# EAGLE design SolarMonitor_Pro (EAGLE 9.2.1)
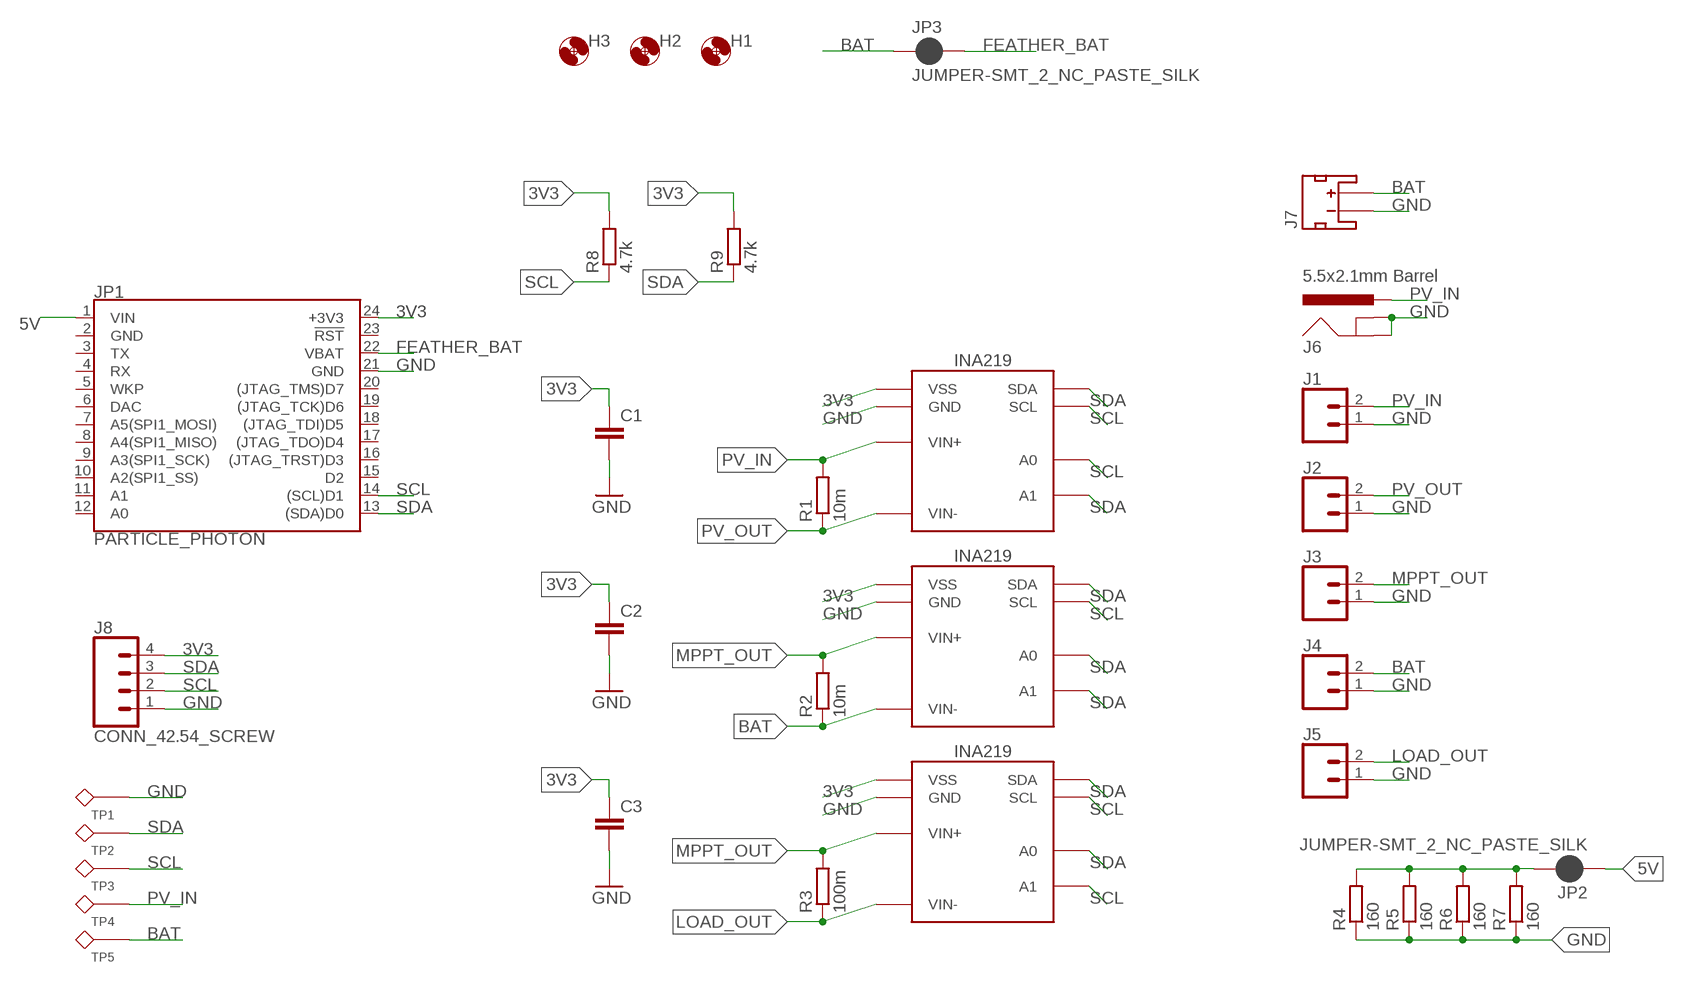
[diagram p0: schematic, sheet 1]

## Parts
C1  C-EU0.1UFC0402  [C0402]
C2  C-EU0.1UFC0402  [C0402]
C3  C-EU0.1UFC0402  [C0402]
H1  MOUNTING_HOLE4_NP  [4_40]
H2  MOUNTING_HOLE4_NP  [4_40]
H3  MOUNTING_HOLE4_NP  [4_40]
J1  CONN_023.5MM  [SCREWTERMINAL-3.5MM-2]
J2  CONN_023.5MM  [SCREWTERMINAL-3.5MM-2]
J3  CONN_023.5MM  [SCREWTERMINAL-3.5MM-2]
J4  CONN_023.5MM  [SCREWTERMINAL-3.5MM-2]
J5  CONN_023.5MM  [SCREWTERMINAL-3.5MM-2]
J6  5.5x2.1mm Barrel  POWER_JACKSMD  [POWER_JACK_SMD]
J7  JST_2MM_MALE  [JST-2-SMD]
J8  CONN_42.54_SCREW  [1X04_SCREW]
JP1  PARTICLE_PHOTON  [PARTICLE_PHOTON]
JP2  JUMPER-SMT_2_NC_PASTE_SILK  [SMT-JUMPER_2_NC_PASTE_SILK]
JP3  JUMPER-SMT_2_NC_PASTE_SILK  [SMT-JUMPER_2_NC_PASTE_SILK]
R1  10m  R-EU_R0805  [R0805]
R2  10m  R-EU_R0805  [R0805]
R3  100m  R-EU_R0805  [R0805]
R4  160  R-EU_R1206  [R1206]
R5  160  R-EU_R1206  [R1206]
R6  160  R-EU_R1206  [R1206]
R7  160  R-EU_R1206  [R1206]
R8  4.7k  R-EU_4.7KR0402  [R0402]
R9  4.7k  R-EU_4.7KR0402  [R0402]
TP1  TESTPOINTRCU  [TESTPOINT_0603]
TP2  TESTPOINTRCU  [TESTPOINT_0603]
TP3  TESTPOINTRCU  [TESTPOINT_0603]
TP4  TESTPOINTRCU  [TESTPOINT_0603]
TP5  TESTPOINTRCU  [TESTPOINT_0603]
U1  INA219DCN  [DCN_R-PDSO-G8]
U2  INA219DCN  [DCN_R-PDSO-G8]
U3  INA219DCN  [DCN_R-PDSO-G8]

## Nets
3V3: C1.1 C2.1 C3.1 J8.4 JP1.24(+3V3) R8.2 R9.2 U1.4(VSS) U2.4(VSS) U3.4(VSS)
5V: JP1.1(VIN) JP2.1
BAT: J4.2 J7.2(+) JP3.1 R2.1 TP5.1 U2.2(VIN-)
FEATHER_BAT: JP1.22(VBAT) JP3.2
GND: C1.2 C2.2 C3.2 J1.1 J2.1 J3.1 J4.1 J5.1 J6.GND(GNDBREAK) J6.P$4(GND) J7.1(-) J8.1 JP1.21(GND) R4.1 R5.1 R6.1 R7.1 TP1.1 U1.3(GND) U2.3(GND) U3.3(GND)
LOAD: JP2.2 R4.2 R5.2 R6.2 R7.2
LOAD_OUT: J5.2 R3.1 U3.2(VIN-)
MPPT_OUT: J3.2 R2.2 R3.2 U2.1(VIN+) U3.1(VIN+)
PV_IN: J1.2 J6.VIN0(PWR) R1.2 TP4.1 U1.1(VIN+)
PV_OUT: J2.2 R1.1 U1.2(VIN-)
SCL: J8.2 JP1.14((SCL)D1) R8.1 TP3.1 U1.5(SCL) U1.7(A0) U2.5(SCL) U3.5(SCL) U3.8(A1)
SDA: J8.3 JP1.13((SDA)D0) R9.1 TP2.1 U1.6(SDA) U1.8(A1) U2.6(SDA) U2.7(A0) U2.8(A1) U3.6(SDA) U3.7(A0)
Unconnected: J7.NC1(PAD1) J7.NC2(PAD2) JP1.3(TX) JP1.4(RX) JP1.5(WKP) JP1.6(DAC) JP1.7(A5(SPI1_MOSI)) JP1.8(A4(SPI1_MISO)) JP1.9(A3(SPI1_SCK)) JP1.10(A2(SPI1_SS)) JP1.11(A1) JP1.12(A0) JP1.15(D2) JP1.16((JTAG_TRST)D3) JP1.17((JTAG_TDO)D4) JP1.18((JTAG_TDI)D5) JP1.19((JTAG_TCK)D6) JP1.20((JTAG_TMS)D7) JP1.23(!RST!)

## Power pins joined to a net without a drawn wire
GND: JP1.2(GND)

## Library data of the parts
C1-C3 = bschulz_passives:C-EU: CAPACITOR, European symbol; DIGIKEY: 490-4759-1-ND; MF: Murata; MPN: GCM155R71C104KA55D
H1-H3 = bschulz:MOUNTING_HOLE: Genaric Mechanical Mounting Hole Hole diameter based on max body diameter + 15% Keepout ring is for diameter of socket cap screw (minimum required clearance) TPlace ring is for diameter of pan head screw (recomended clearance) Specifications: Socket Cap <http://fastener-express.com/fastener-technical/SocketscapSS-Alloy.pdf> Button Head Socket Cap <http://fastener-express.com/fastener-technical/Button-Socket-alloy.pdf> Pan Head <http://fastener-express.com/fastener-technical/pan-machine-Screws.pdf>
J1-J5 = bschulz:CONN_02: Genaric 2 terminal header SCREW_2.54 <https://www.digikey.com/product-detail/en/on-shore-technology-inc/OSTVN02A150/ED10561-ND/1588862>; PROD_ID: CONN-08399
J6 = bschulz:POWER_JACK: Power Jack Connector This is the standard 5.5mm barrel jack for power. The PTH is the most common, proven, reliable, footprint. The Slot footprint only works if the mill layer is transmitted to the PCB fab house so be warned. Here are the connectors we sell at SparkFun: DC Barrel Power Jack/Connector <https://www.sparkfun.com/products/119> (PRT-00119) DC Barrel Power Jack/Connector (SMD) <https://www.sparkfun.com/products/12748> (PRT-12748) DC Barrel Jack Adapter - Breadboard Compatible <https://www.sparkfun.com/products/10811> (PRT-10811) It is used on this SparkFun product (and many, many others): SparkFun RedBoard - Programmed with Arduino <https://www.sparkfun.com/products/12757> (DEV-12757) Also, if you need a mating power supply or connector, please check these out: Wall Adapter Power Supply - 9VDC 650mA <https://www.sparkfun.com/products/298> (TOL-00298) DC Barrel Jack Adapter - Male <https://www.sparkfun.com/products/10287> (PRT-10287); DIGIKEY: 732-5929-1-ND; MF: Wurth; MPN: 694106106102
J7 = bschulz:JST_2MM_MALE: JST 2MM MALE RA CONNECTOR Two pin, compact surface mount connector. Commonly used as a battery input connection point. We really like the solid locking feeling and high current rating on these small connectors. We use these all the time as battery connectors. Mates to single-cell LiPo batteries. Here is the connector we sell at SparkFun: JST Right Angle Connector - White <https://www.sparkfun.com/products/8612> (PRT-08612) Datasheet <http://www.sparkfun.com/datasheets/Prototyping/Connectors/JST-Horizontal.pdf> It was used on these SparkFun products: SparkFun MOSFET Power Controller <https://www.sparkfun.com/products/11214> (PRT-11214) SparkFun Battery Babysitter - LiPo Battery Manager <https://www.sparkfun.com/products/13777> (PRT-13777) And many, many others that required a lipo battery connection.; DIGIKEY: 455-1749-1-ND; MF: JST; MPN: S2B-PH-SM4-TB(LF)(SN)
J8 = bschulz:CONN_4: Genaric 4 terminal header Digikey 2.54_SCREW <https://www.digikey.com/product-detail/en/on-shore-technology-inc/OSTVN04A150/ED10563-ND/1588864>; DIGIKEY: ED10563-ND; MF: On Shore; MPN: OSTVN04A150
JP1 = SparkFun-Boards:PARTICLE_PHOTON: Particle Photon Footprint of the Particle Photon that is used as a basis for many Photon shields. SparkFun Products: Particle Photon <https://www.sparkfun.com/products/13764> SparkFun Photon ProtoShield <https://www.sparkfun.com/products/13598> SparkFun Photon micro OLED Shield <https://www.sparkfun.com/products/13628> SparkFun Photon IMU Shield <https://www.sparkfun.com/products/13629> SparkFun Photon Battery Shield <https://www.sparkfun.com/products/13626>
JP2 JP3 = SparkFun-Jumpers:JUMPER-SMT_2_NC_PASTE: Normally closed solder jumper This jumper has an aperture in the stencil to allow solder paste to bridge the split in the wire so it's normally closed (NC). Wick off the solder to open the connection. Reapply solder to reclose the connection.
R1-R7 = bschulz_passives:R-EU_: RESISTOR, European symbol Digikey Parts: Yageo, 0402 <https://www.digikey.com/products/en/resistors/chip-resistor-surface-mount/52?k=&pkeyword=&sf=0&FV=ffec1104%2Cfffc000d%2C1c0002%2C440067%2C1f140000%2Cffe00034%2C400004&quantity=&ColumnSort=0&page=1&stock=1&pageSize=25> Yageo, 0603 <https://www.digikey.com/products/en/resistors/chip-resistor-surface-mount/52?k=&pkeyword=&s=4356&s=47360&sf=0&FV=fffc000d%2C1c0002%2C142c040c%2C1f140000%2Cffe00034&quantity=10&ColumnSort=1000011&page=1&stock=1&pageSize=25> Panasonic, 0603 <https://www.digikey.com/products/en/resistors/chip-resistor-surface-mount/52?k=&pkeyword=&pv252=68&sf=0&FV=ffec373d%2C1c0002%2C142c040c%2C1f140000%2Cffe00034%2C80002%2Cc0001&quantity=&ColumnSort=0&page=1&stock=1&pageSize=25> Panasonic, precision, 0603 <https://www.digikey.com/products/en/resistors/chip-resistor-surface-mount/52?FV=ffec4907%2Cfffc000a%2Cc0172%2C142c040c%2C1f140000%2Cffe00034%2C1c0002&quantity=100&ColumnSort=2085&page=1&stock=1&pageSize=25> Panasonic, 0805 <https://www.digikey.com/products/en/resistors/chip-resistor-surface-mount/52?k=&pkeyword=&pv3=1&sf=0&FV=ffec373d%2C1c0002%2C1f140000%2Cffe00034%2C142c040d&quantity=&ColumnSort=0&page=1&stock=1&pageSize=25> Rohm, current sense <https://www.digikey.com/products/en/resistors/chip-resistor-surface-mount/52?k=&pkeyword=&pv3=1&sf=0&FV=ffecb688%2C1f140000%2Cffe00034%2C1c0002&quantity=&ColumnSort=0&page=1&stock=1&pageSize=25> Vishay, pulse proof automotive <https://www.digikey.com/products/en/resistors/chip-resistor-surface-mount/52?k=&pkeyword=&pv7=2&sf=0&FV=ffec5d6b%2Cffe00034%2C1f140000&quantity=&ColumnSort=0&page=1&stock=1&pageSize=25>
R8 R9 = bschulz_passives:R-EU_: RESISTOR, European symbol Digikey Parts: Yageo, 0402 <https://www.digikey.com/products/en/resistors/chip-resistor-surface-mount/52?k=&pkeyword=&sf=0&FV=ffec1104%2Cfffc000d%2C1c0002%2C440067%2C1f140000%2Cffe00034%2C400004&quantity=&ColumnSort=0&page=1&stock=1&pageSize=25> Yageo, 0603 <https://www.digikey.com/products/en/resistors/chip-resistor-surface-mount/52?k=&pkeyword=&s=4356&s=47360&sf=0&FV=fffc000d%2C1c0002%2C142c040c%2C1f140000%2Cffe00034&quantity=10&ColumnSort=1000011&page=1&stock=1&pageSize=25> Panasonic, 0603 <https://www.digikey.com/products/en/resistors/chip-resistor-surface-mount/52?k=&pkeyword=&pv252=68&sf=0&FV=ffec373d%2C1c0002%2C142c040c%2C1f140000%2Cffe00034%2C80002%2Cc0001&quantity=&ColumnSort=0&page=1&stock=1&pageSize=25> Panasonic, precision, 0603 <https://www.digikey.com/products/en/resistors/chip-resistor-surface-mount/52?FV=ffec4907%2Cfffc000a%2Cc0172%2C142c040c%2C1f140000%2Cffe00034%2C1c0002&quantity=100&ColumnSort=2085&page=1&stock=1&pageSize=25> Panasonic, 0805 <https://www.digikey.com/products/en/resistors/chip-resistor-surface-mount/52?k=&pkeyword=&pv3=1&sf=0&FV=ffec373d%2C1c0002%2C1f140000%2Cffe00034%2C142c040d&quantity=&ColumnSort=0&page=1&stock=1&pageSize=25> Rohm, current sense <https://www.digikey.com/products/en/resistors/chip-resistor-surface-mount/52?k=&pkeyword=&pv3=1&sf=0&FV=ffecb688%2C1f140000%2Cffe00034%2C1c0002&quantity=&ColumnSort=0&page=1&stock=1&pageSize=25> Vishay, pulse proof automotive <https://www.digikey.com/products/en/resistors/chip-resistor-surface-mount/52?k=&pkeyword=&pv7=2&sf=0&FV=ffec5d6b%2Cffe00034%2C1f140000&quantity=&ColumnSort=0&page=1&stock=1&pageSize=25>; DIGIKEY: 311-4.7KJRCT-ND; MF: Yageo; MPN: RC0402JR-074K7L; VALUE_PART: 4.7k
TP1-TP5 = bschulz:TESTPOINT; DIGIKEY: A106145CT-ND; MF: TE Connectivity; MPN: RCU-0C
U1-U3 = bschulz:INA219: INA219 - Zero Drift Bidirectional Current/Power Monitor with I2C Interface Characteristics: Vcc: 3V ~ 5.5V Iq: 700uA Common Mode Range: 0V ~ 26V Operating Temperature: -40°C to 125°C Digikey: SOIC (D) <https://www.digikey.com/product-detail/en/texas-instruments/INA219AIDR/296-23978-1-ND/1984895> SOT-23 (DCN) <https://www.digikey.com/product-detail/en/texas-instruments/INA219AIDCNR/296-23770-1-ND/1952550>; DIGIKEY: 296-23770-1-ND; MF: TI; MPN: INA219AIDCNR

## Board
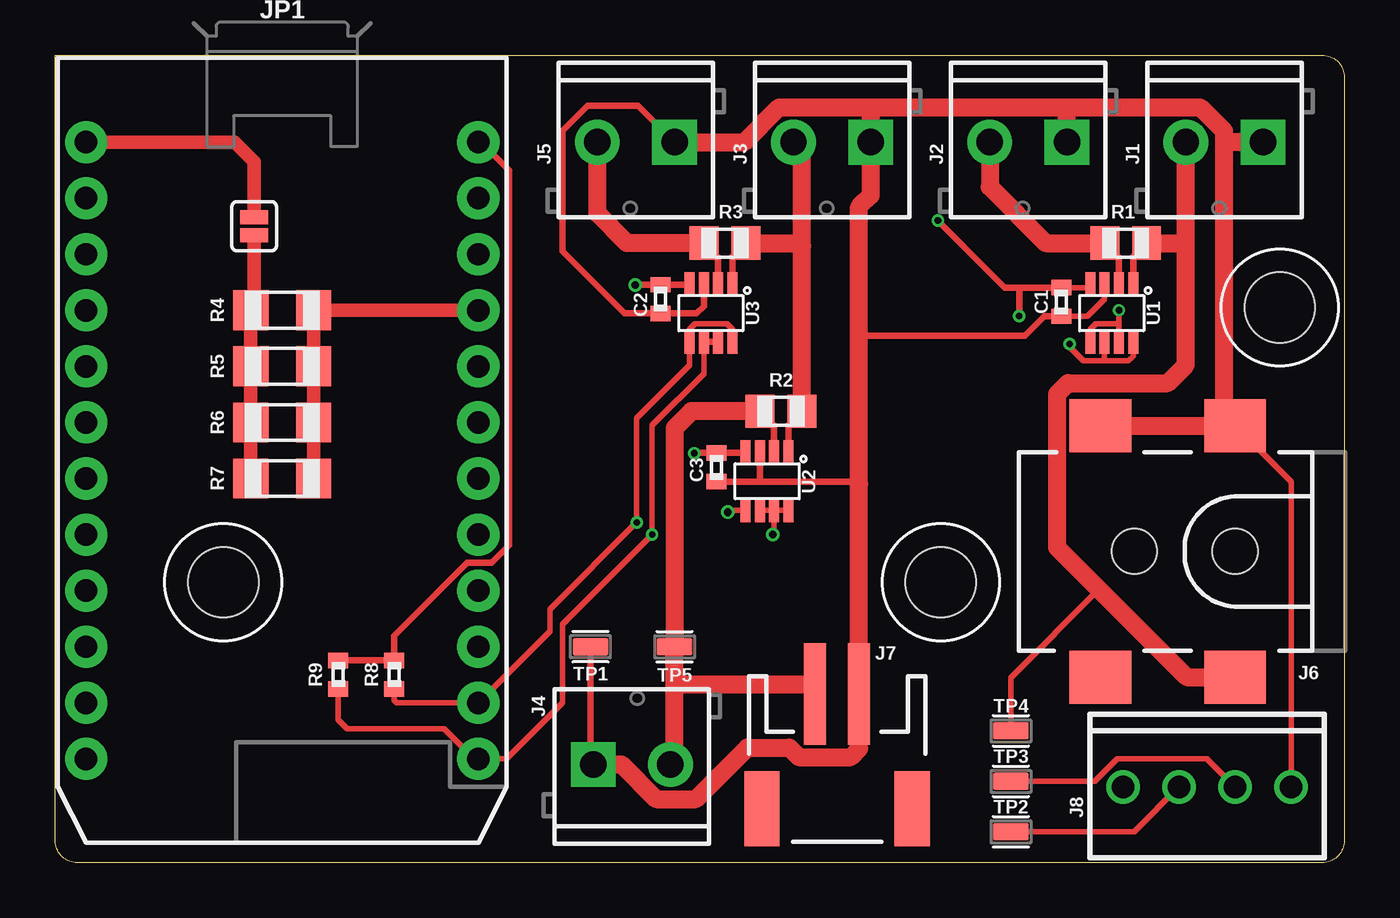
[diagram p1: board, top side]
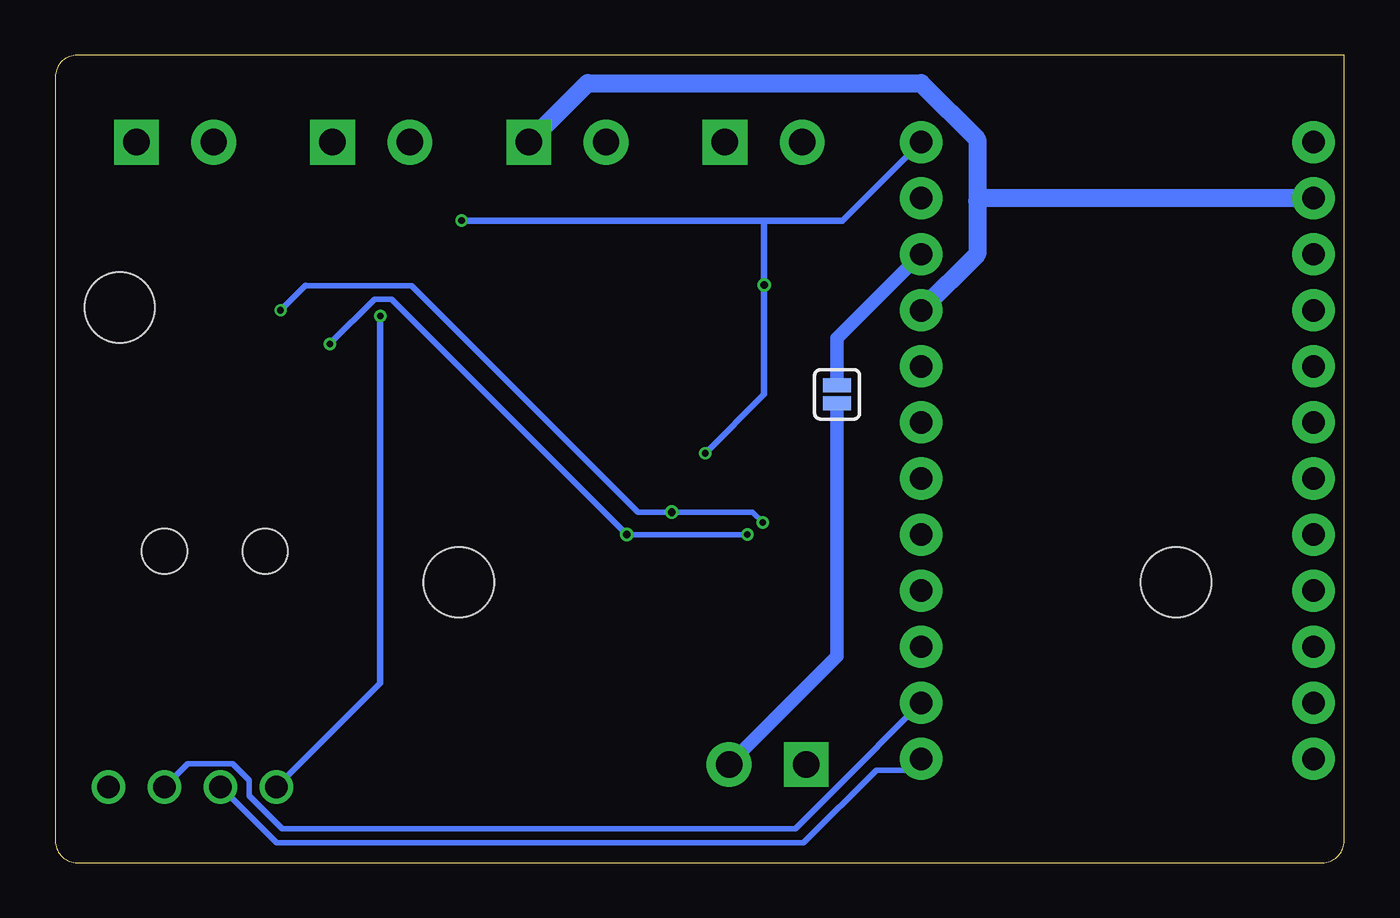
[diagram p2: board, bottom side, seen from below]

Size 58.42 x 36.58 mm. Coordinates in mm from the lower left corner, seen from the top.
Outline: 0,36.58 57.42,36.58 arc-90 58.42,35.58 58.42,1 arc-90 57.42,0 1,0 arc-90 0,1 0,36.58
Copper layers (1*16): Top 0.035559375mm / dielectric 1.6mm / Bottom 0.035559375mm
Design rules "oshpark-2layer": minimum track width 6mil, minimum drill 10mil, track to track 6mil, track to pad 6mil, pad to pad 6mil, via to via 6mil, smd to smd 6mil, copper to edge 15mil, drill to drill 6mil, minimum pad ring 5mil, minimum via ring 5mil, stop-mask expansion 2.5mil, vias tented up to drill 0mil, thermal gap 10mil

### Footprints (pad centres in the part's own frame; a part is rotated, then mirrored left to right if it is on the bottom)
C0402 = smd 0.7 x 0.9: 1 -0.65,0; 2 0.65,0
4_40 = hole 3.175: 0,0
SCREWTERMINAL-3.5MM-2 = drill 1.2 pad 2.032 square: 1 0,0 | drill 1.2 pad 2.032: 2 3.5,0
POWER_JACK_SMD = smd 2.8 x 2.4: GND 0,-5.7; P$4 6.1,-5.7; VIN0 0,5.7; VIN1 6.1,5.7 | hole 2.032: 0,0; 4.572,0
JST-2-SMD = smd 1 x 4.6: 1 -1,-3.7; 2 1,-3.7 | smd 1.6 x 3.4: NC1 -3.4,1.5; NC2 3.4,1.5
1X04_SCREW = drill 1.016: 1 -3.81,0; 2 -1.27,0; 3 1.27,0; 4 3.81,0
PARTICLE_PHOTON = drill 1.016 pad 1.905: 1 -8.89,13.97; 2 -8.89,11.43; 3 -8.89,8.89; 4 -8.89,6.35; 5 -8.89,3.81; 6 -8.89,1.27; 7 -8.89,-1.27; 8 -8.89,-3.81; 9 -8.89,-6.35; 10 -8.89,-8.89; 11 -8.89,-11.43; 12 -8.89,-13.97; 13 8.89,-13.97; 14 8.89,-11.43; 15 8.89,-8.89; 16 8.89,-6.35; 17 8.89,-3.81; 18 8.89,-1.27; 19 8.89,1.27; 20 8.89,3.81; 21 8.89,6.35; 22 8.89,8.89; 23 8.89,11.43; 24 8.89,13.97
SMT-JUMPER_2_NC_PASTE_SILK = smd 0.635 x 1.27: 1 -0.406,0; 2 0.406,0
R0805 = smd 1.3 x 1.5: 1 -0.95,0; 2 0.95,0
R1206 = smd 1.6 x 1.803: 1 -1.422,0; 2 1.422,0
R0402 = smd 0.7 x 0.9: 1 -0.65,0; 2 0.65,0
TESTPOINT_0603 = smd 1.6 x 0.8: 1 0,0
DCN_R-PDSO-G8 = smd 0.45 x 1.1: 1 -0.975,-1.3; 2 -0.325,-1.3; 3 0.325,-1.3; 4 0.975,-1.3; 5 0.975,1.3; 6 0.325,1.3; 7 -0.325,1.3; 8 -0.975,1.3

### Placement (x,y rotation side)
C1  45.59,25.4 270 top
C2  27.43,25.53 270 top
C3  29.97,17.91 270 top
H1  40.13,12.7 0 top
H2  7.62,12.7 0 top
H3  55.5,25.15 0 top
J1  54.74,32.64 180 top
J2  45.85,32.64 180 top
J3  36.96,32.64 180 top
J4  24.38,4.45 0 top
J5  28.07,32.64 180 top
J6  53.47,14.1 180 top
J7  35.43,3.94 180 top
J8  52.2,3.43 180 top
JP1  10.29,18.67 0 top
JP2  9.02,28.83 270 top
JP3  22.99,21.21 90 bottom
R1  48.51,28.07 0 top
R2  32.89,20.45 0 top
R3  30.35,28.07 0 top
R4  10.29,25.02 180 top
R5  10.29,22.48 180 top
R6  10.29,19.94 180 top
R7  10.29,17.4 180 top
R8  15.37,8.51 90 top
R9  12.83,8.51 90 top
TP1  24.26,9.78 180 top
TP2  43.31,1.4 0 top
TP3  43.31,3.68 0 top
TP4  43.31,5.97 0 top
TP5  28.07,9.78 0 top
U1  47.88,24.89 180 top
U2  32.26,17.27 180 top
U3  29.72,24.89 180 top

### Tracks (layer width: path | path; a pad name or v marks a point on that pad's centre or on a via)
3V3  (via drill 0.3, 0.35)
  Top 0.254: U1.4 46.76,26.05 C1.1
  Top 0.305: R9.2 R8.2 15.37,10.29 18.66,13.58 19.78,13.58 20.57,14.37 20.57,31.37 19.3,32.64 JP1.24 | v40.01,29.08 43.04,26.05 43.69,26.05 | 43.69,26.05 C1.1 | v43.69,24.77 43.69,26.05 | U3.4 28.73,26.18 C2.1 26.3,26.18 v26.29,26.16 | U2.4 31.27,18.56 C3.1 28.97,18.56 v28.96,18.54
  Bottom 0.305: J8.4 43.69,8.13 v43.69,24.77 | JP1.24 22.73,29.08 26.29,29.08 | 26.29,29.08 v40.01,29.08 | 26.29,29.08 v26.29,26.16 26.29,21.21 v28.96,18.54
5V
  Top 0.61: JP1.1 8.13,32.64 9.02,31.75 JP2.1
BAT
  Top 0.305: U2.2 32.58,19.81 R2.1
  Top 0.813: J7.2 34.43,8.06 28.12,8.06 28.07,8 | R2.1 28.83,20.45 28.07,19.68 TP5.1 28.07,8 | J4.2 28.07,4.63 28.07,8
  Bottom 0.61: JP3.1 22.99,9.34 J4.2
FEATHER_BAT
  Bottom 0.61: JP3.2 22.99,23.75 JP1.22
GND
  Top 0.254: J8.1 56.01,17.26 53.59,19.68 J6.GND | C1.2 46.78,24.75 47.55,25.52 U1.3
  Top 0.305: 24.26,9.53 TP1.1 24.26,4.57 J4.1 | C1.2 44.82,24.75 43.94,23.88 36.43,23.88 | U3.3 29.39,25.2 29.07,24.88 C2.2 25.8,24.88 22.99,27.69 22.99,33.15 24.13,34.29 26.42,34.29 J5.1 | 36.43,17.14 36.32,17.26 31.88,17.26 | C3.2 31.88,17.26 | U2.3 31.93,17.31 31.88,17.26
  Top 0.61: R7.1 R6.1 R5.1 R4.1 JP1.21
  Top 0.813: J5.1 31.23,32.64 32.8,34.21 36.83,34.21 | 36.83,34.21 45.85,34.21 | 45.85,34.21 51.89,34.21 52.96,33.14 52.96,32.51 | J2.1 45.85,34.21 | 36.83,34.21 36.96,34.09 J3.1 36.96,30.23 36.43,29.7 36.43,23.88 36.43,17.14 J7.1 36.43,5.16 36.05,4.78 33.7,4.78 33.27,5.21 31.37,5.21 29.03,2.87 27.23,2.87 25.66,4.45 J4.1 | J6.P$4 J6.GND | 53.59,19.68 52.96,20.3 52.96,32.51 | J1.1 53.09,32.64 52.96,32.51
  Bottom 0.813: J3.1 34.29,35.31 19.18,35.31 16.64,32.77 16.64,29.97 | JP1.21 16.64,27.56 16.64,29.97 | JP1.2 16.51,30.1 16.64,29.97
LOAD
  Top 0.61: JP2.2 9.02,25.17 R4.2 R5.2 R6.2 R7.2
LOAD_OUT
  Top 0.305: U3.2 30.04,27.43 R3.1
  Top 0.813: R3.1 25.91,28.07 24.57,29.41 J5.2
MPPT_OUT
  Top 0.305: U2.1 33.23,19.84 R2.2 | U3.1 30.69,27.46 R3.2
  Top 0.813: R2.2 33.84,27.94 | 33.84,27.94 33.84,32.25 J3.2 | 33.84,27.94 33.72,28.07 R3.2
PV_IN
  Top 0.254: TP4.1 43.31,8.38 47.3,12.38
  Top 0.305: 49.94,28.54 R1.2 48.85,27.46 U1.1
  Top 0.813: J6.VIN0 51.28,8.4 47.3,12.38 45.41,14.27 45.41,21.23 45.9,21.72 50.42,21.72 51.24,22.54 51.24,28.07 | 51.24,28.07 J1.2 | R1.2 51.24,28.07
PV_OUT
  Top 0.305: U1.2 48.2,27.43 R1.1
  Top 0.813: J2.2 42.35,30.61 44.89,28.07 R1.1
SCL  (via drill 0.3, 0.35)
  Top 0.254: TP3.1 47.12,3.68 48.13,4.7 52.2,4.7 J8.2 | R8.1 15.37,7.35 15.48,7.24 JP1.14 22.43,10.49 22.43,11.48 v26.35,15.41 26.35,20.13 28.74,22.52 U3.5 28.74,24.17 28.99,24.42 30.44,24.42 30.69,24.17 U3.8 | U1.5 46.9,24.17 47.15,24.42 48.11,24.42 48.2,24.51 | U1.7 48.2,24.51 | 48.2,24.51 v48.2,25.02 v48.21,25.02 | U2.5 30.58,15.97 v30.48,15.88
  Bottom 0.254: 47.06,26.16 47.09,26.14 | 47.09,26.14 v48.21,25.02 | JP1.14 23.09,3.33 23.09,3.31 24.88,1.52 48.13,1.52 49.63,3.02 49.63,3.73 50.37,4.47 52.43,4.47 J8.2 | 47.09,26.14 42.26,26.14 32,15.88 v30.48,15.88 26.82,15.88 v26.35,15.41
SDA  (via drill 0.3, 0.35)
  Top 0.254: TP2.1 48.9,1.4 J8.3 | R9.1 12.83,6.48 13.23,6.07 17.62,6.07 18.99,4.7 JP1.13 20.45,4.7 22.99,7.24 22.99,10.79 v27.05,14.86 27.05,19.81 29.39,22.15 U3.6 | 47.5,22.73 48.64,22.73 48.85,22.95 U1.8 | 47.5,22.73 46.59,22.73 45.97,23.35 v45.97,23.5 | U1.6 47.55,22.79 47.5,22.73 | U2.6 U2.7 | U2.7 U2.8 | U2.7 32.58,14.93 v32.51,14.86
  Top 0.305: U3.7 U3.6
  Bottom 0.254: v45.97,23.5 43.94,25.53 43.18,25.53 v32.51,14.86 v27.05,14.86 | JP1.13 19.68,4.19 21.21,4.19 24.51,0.89 48.39,0.89 J8.3

### Text on the board
tDocu: J0 | From Solar | To Load | From MPPT | To MPPT | From Solar | GND | Bat | To Bat | PV | SCL | To Bat | SDA
bDocu: + - | + - | + - | + - | Project LEAF / Solar Power Monitor v0 / Designed by Bobby Schulz / 03-18-2019 | J1 | + - | 3v3 | SDA | SCL | GND